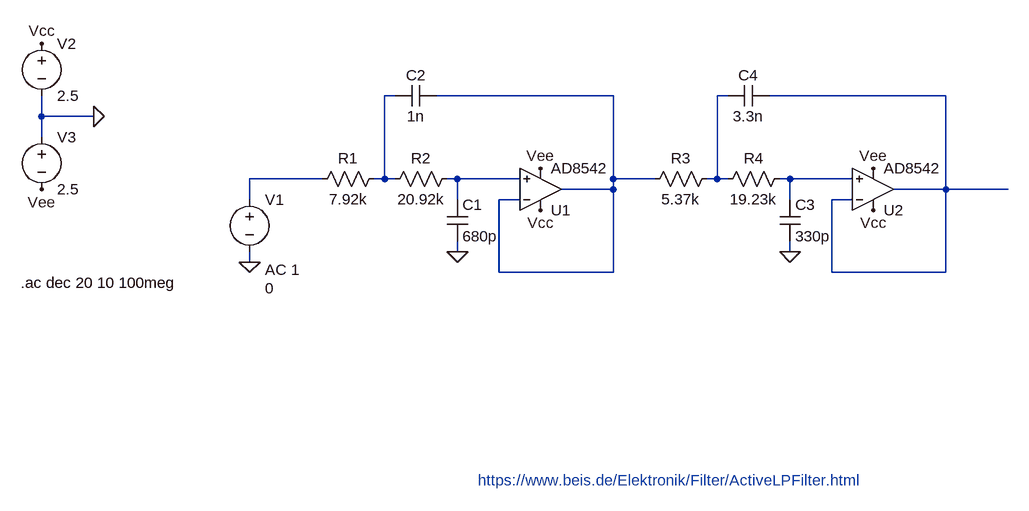
[diagram p0: schematic sallen_key_lowpass_fourth_order.asc]
sallen_key_lowpass_fourth_order.asc, the LTspice schematic file:
Version 4
SHEET 1 932 680
WIRE -224 -112 -240 -112
WIRE 112 -112 -160 -112
WIRE 288 -112 272 -112
WIRE 624 -112 352 -112
WIRE -768 -80 -768 -112
WIRE -688 -80 -768 -80
WIRE -768 -48 -768 -80
WIRE -336 16 -448 16
WIRE -240 16 -240 -112
WIRE -240 16 -256 16
WIRE -224 16 -240 16
WIRE -128 16 -144 16
WIRE -32 16 -128 16
WIRE 112 16 112 -112
WIRE 176 16 112 16
WIRE 272 16 272 -112
WIRE 272 16 256 16
WIRE 288 16 272 16
WIRE 384 16 368 16
WIRE 480 16 384 16
WIRE 112 32 112 16
WIRE 112 32 32 32
WIRE 624 32 624 -112
WIRE 624 32 544 32
WIRE 720 32 624 32
WIRE -448 48 -448 16
WIRE -128 48 -128 16
WIRE -32 48 -64 48
WIRE 384 48 384 16
WIRE 480 48 448 48
WIRE -128 128 -128 112
WIRE 384 128 384 112
WIRE -448 144 -448 128
WIRE -64 160 -64 48
WIRE 112 160 112 32
WIRE 112 160 -64 160
WIRE 448 160 448 48
WIRE 624 160 624 32
WIRE 624 160 448 160
FLAG 0 64 Vcc
FLAG 0 0 Vee
FLAG -128 128 0
FLAG 512 64 Vcc
FLAG 512 0 Vee
FLAG 384 128 0
FLAG -448 144 0
FLAG -688 -80 0
FLAG -768 32 Vee
FLAG -768 -192 Vcc
SYMBOL OpAmps\\AD8542 0 96 M180
SYMATTR InstName U1
SYMBOL res -240 0 R90
WINDOW 0 0 56 VBottom 2
WINDOW 3 32 56 VTop 2
SYMATTR InstName R1
SYMATTR Value 7.92k
SYMBOL res -128 0 R90
WINDOW 0 0 56 VBottom 2
WINDOW 3 32 56 VTop 2
SYMATTR InstName R2
SYMATTR Value 20.92k
SYMBOL cap -144 48 R0
SYMATTR InstName C1
SYMATTR Value 680p
SYMBOL cap -160 -128 R90
WINDOW 0 0 32 VBottom 2
WINDOW 3 32 32 VTop 2
SYMATTR InstName C2
SYMATTR Value 1n
SYMBOL OpAmps\\AD8542 512 96 M180
SYMATTR InstName U2
SYMBOL res 272 0 R90
WINDOW 0 0 56 VBottom 2
WINDOW 3 32 56 VTop 2
SYMATTR InstName R3
SYMATTR Value 5.37k
SYMBOL res 384 0 R90
WINDOW 0 0 56 VBottom 2
WINDOW 3 32 56 VTop 2
SYMATTR InstName R4
SYMATTR Value 19.23k
SYMBOL cap 368 48 R0
SYMATTR InstName C3
SYMATTR Value 330p
SYMBOL cap 352 -128 R90
WINDOW 0 0 32 VBottom 2
WINDOW 3 32 32 VTop 2
SYMATTR InstName C4
SYMATTR Value 3.3n
SYMBOL voltage -448 32 R0
WINDOW 3 24 152 Left 2
WINDOW 123 24 124 Left 2
WINDOW 39 0 0 Left 0
SYMATTR Value 0
SYMATTR Value2 AC 1
SYMATTR InstName V1
SYMBOL voltage -768 -208 R0
WINDOW 123 0 0 Left 0
WINDOW 39 0 0 Left 0
SYMATTR InstName V2
SYMATTR Value 2.5
SYMBOL voltage -768 -64 R0
WINDOW 123 0 0 Left 0
WINDOW 39 0 0 Left 0
SYMATTR InstName V3
SYMATTR Value 2.5
TEXT -800 176 Left 2 !.ac dec 20 10 100meg
TEXT -96 480 Left 2 ;https://www.beis.de/Elektronik/Filter/ActiveLPFilter.html

The netlist it stands for:
* sallen_key_lowpass_fourth_order.asc
XU1 N006 N002 Vcc Vee N002 AD8542  ; pins In+ In- V+ V- OUT
R1 N001 N005 7.92k
R2 N006 N001 20.92k
C1 N006 0 680p
C2 N002 N001 1n
XU2 N007 N004 Vcc Vee N004 AD8542  ; pins In+ In- V+ V- OUT
R3 N003 N002 5.37k
R4 N007 N003 19.23k
C3 N007 0 330p
C4 N004 N003 3.3n
V1 N005 0 0 AC 1
V2 Vcc 0 2.5
V3 0 Vee 2.5
.ac dec 20 10 100meg
* https://www.beis.de/Elektronik/Filter/ActiveLPFilter.html
.lib AD8542.sub
.backanno
.end